# EAGLE design lens (EAGLE 7.7.0)
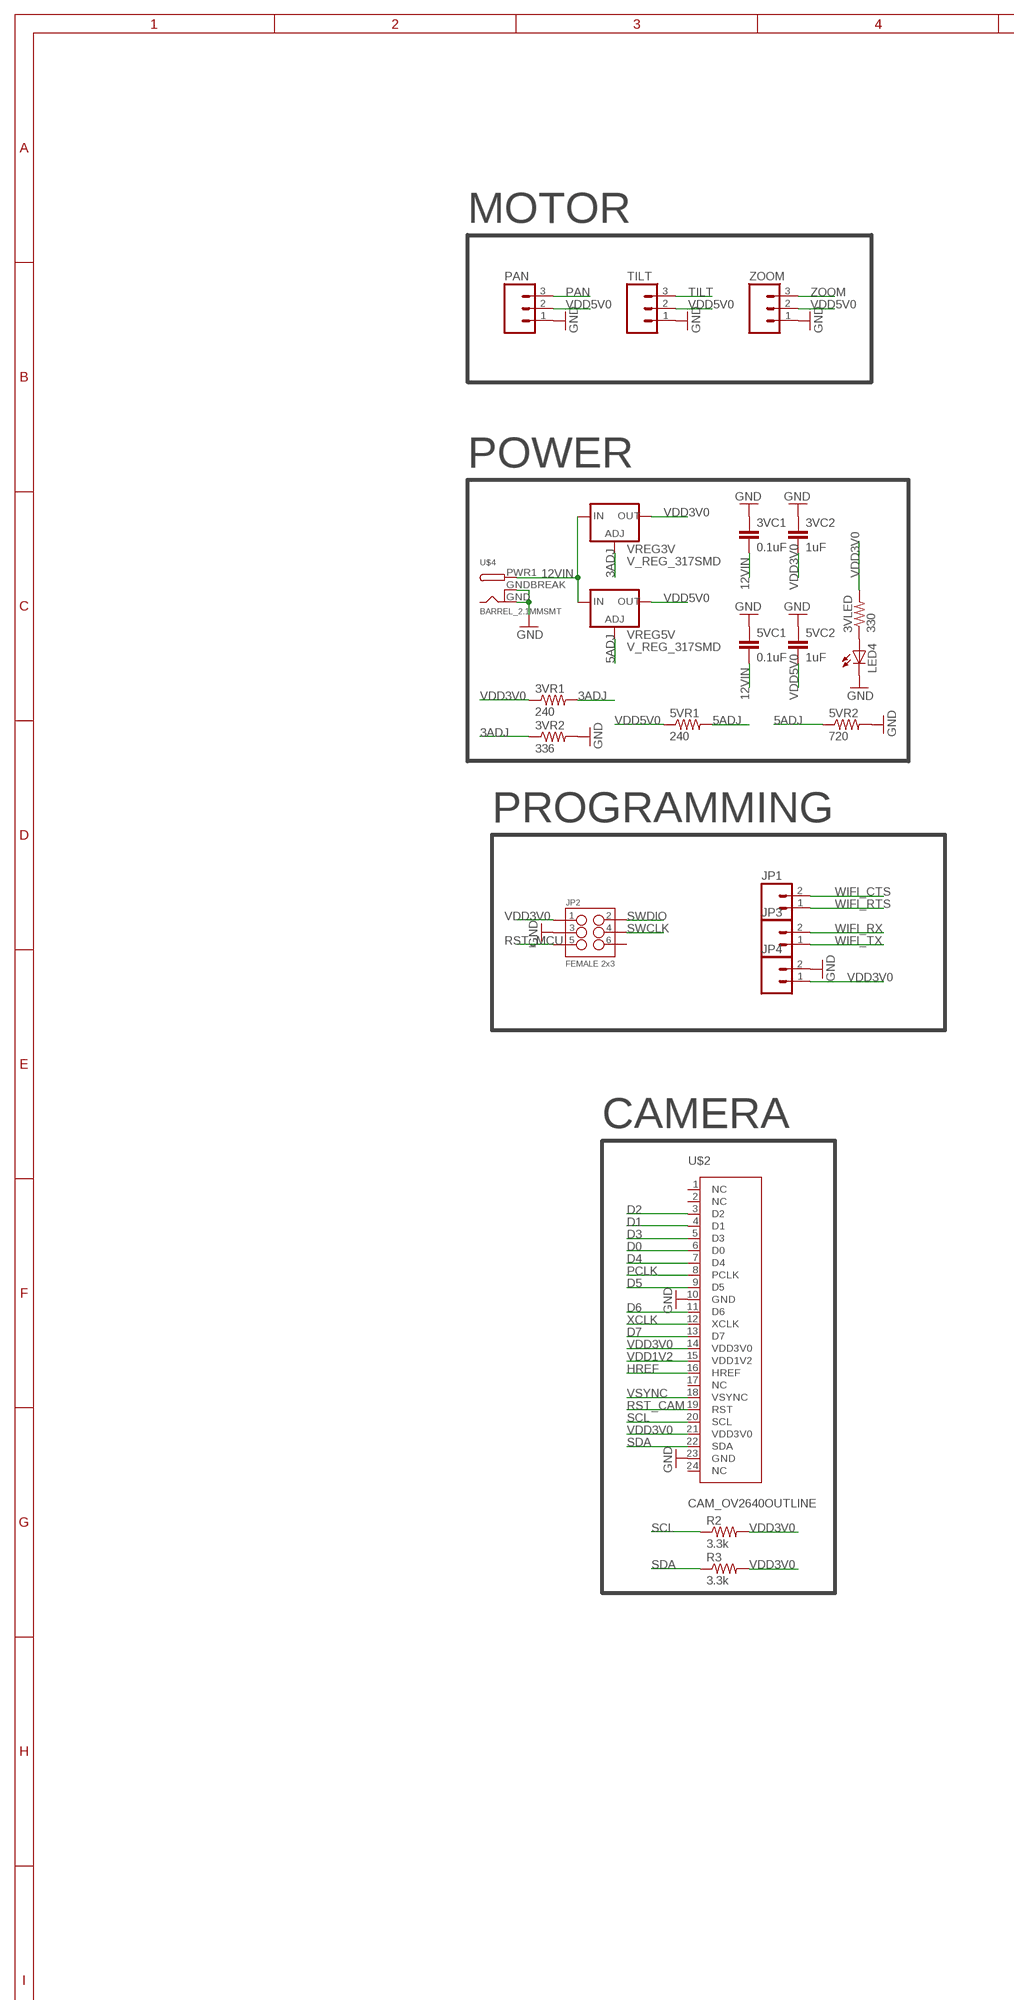
[diagram p0: schematic, sheet 1, part 1 of 2]
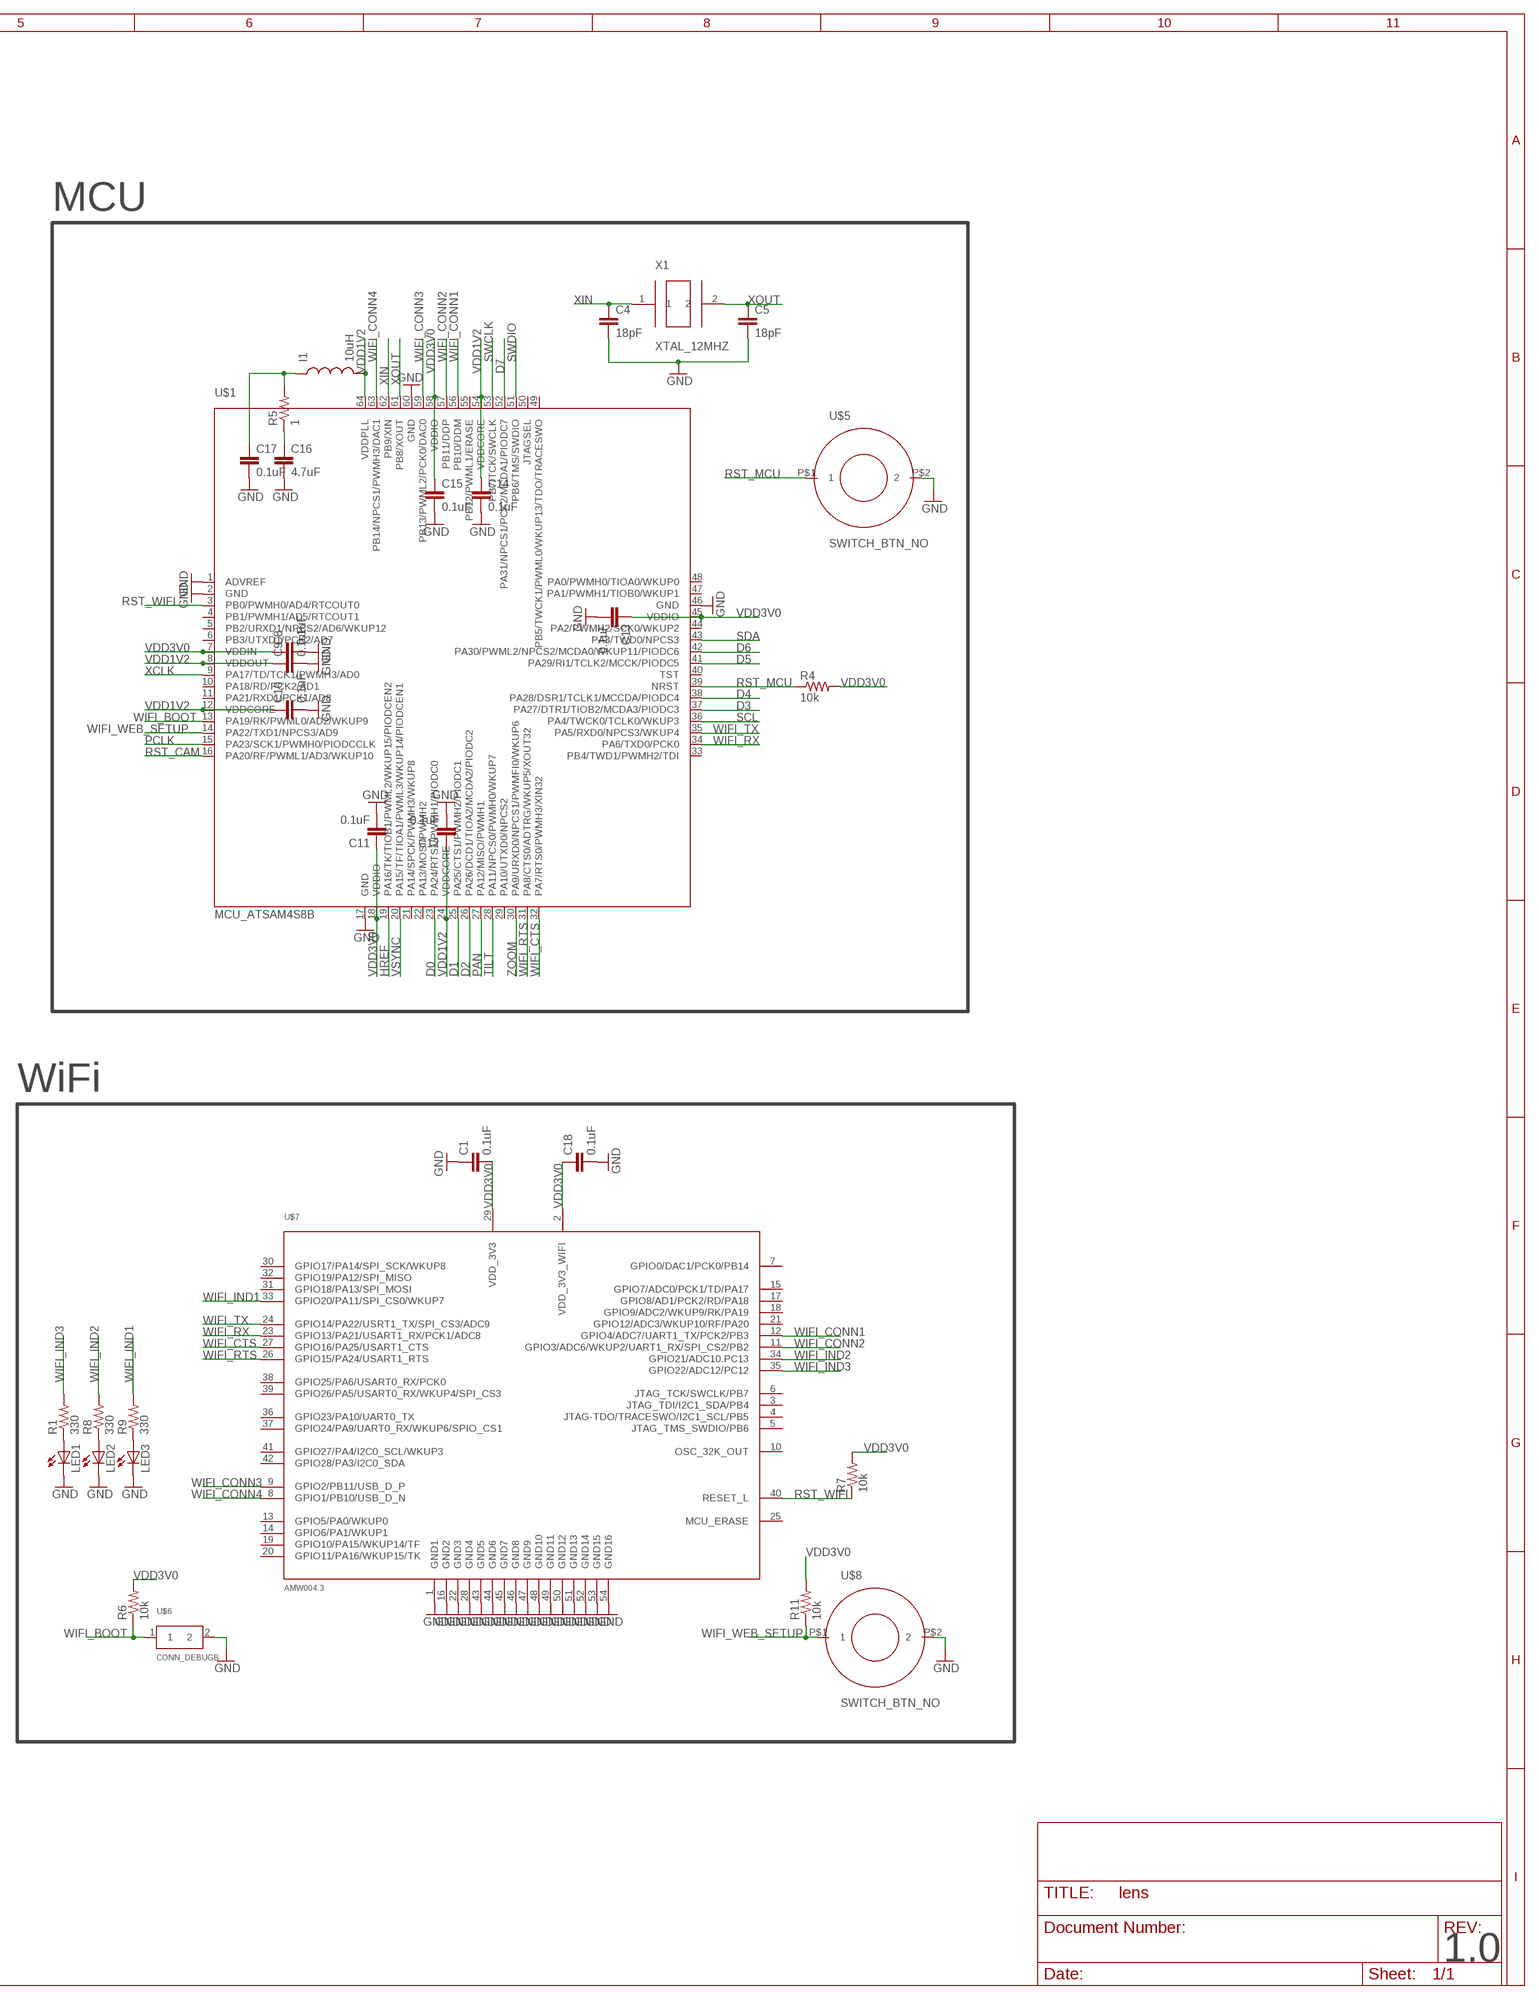
[diagram p1: schematic, sheet 1, part 2 of 2]

## Parts
3VC1  0.1uF  CAP  [0805]
3VC2  1uF  CAP  [0805]
3VLED  330  RES  [0805]
3VR1  240  RES  [0805]
3VR2  336  RES  [0805]
5VC1  0.1uF  CAP  [0805]
5VC2  1uF  CAP  [0805]
5VR1  240  RES  [0805]
5VR2  720  RES  [0805]
C1  0.1uF  CAP  [0805]
C4  18pF  CAP  [0805]
C5  18pF  CAP  [0805]
C8  0.1uF  CAP  [0805]
C9  0.1uF  CAP  [0805]
C10  0.1uF  CAP  [0805]
C11  0.1uF  CAP  [0805]
C12  0.1uF  CAP  [0805]
C13  0.1uF  CAP  [0805]
C14  0.1uF  CAP  [0805]
C15  0.1uF  CAP  [0805]
C16  4.7uF  CAP  [0805]
C17  0.1uF  CAP  [0805]
C18  0.1uF  CAP  [0805]
I1  10uH  IND  [0805]
JP1  M02PTH  [1X02]
JP2  FEMALE 2x3  M03X2FEMALE  [2X3]
JP3  M02PTH  [1X02]
JP4  M02PTH  [1X02]
LED1  LED0603  [LED-0603]
LED2  LED0603  [LED-0603]
LED3  LED0603  [LED-0603]
LED4  LED0603  [LED-0603]
PAN  M03PTH  [1X03]
R1  330  RES  [0805]
R2  3.3k  RES  [0805]
R3  3.3k  RES  [0805]
R4  10k  RES  [0805]
R5  1  RES  [0805]
R6  10k  RES  [0805]
R7  10k  RES  [0805]
R8  330  RES  [0805]
R9  330  RES  [0805]
R11  10k  RES  [0805]
TILT  M03PTH  [1X03]
U$1  MCU_ATSAM4S8B  [QFP50P1200X1200X160-64N]
U$2  CAM_OV2640OUTLINE  [CAM_CONN]
U$4  BARREL_2.1MMSMT  [DCJACK_2MM_SMT]
U$5  SWITCH_BTN_NO  [BTN_2]
U$6  CONN_DEBUGB  [1X2_SMALL_SMD]
U$7  AMW004.3  [AMW004]
U$8  SWITCH_BTN_NO  [BTN_2]
VREG3V  V_REG_317SMD  [SOT223]
VREG5V  V_REG_317SMD  [SOT223]
X1  XTAL_12MHZ  [ABM7-16.000MHZ-D2Y-T]
ZOOM  M03PTH  [1X03]

## Nets
3ADJ: 3VR1.2 3VR2.1 VREG3V.1(ADJ)
5ADJ: 5VR1.2 5VR2.1 VREG5V.1(ADJ)
12VIN: 3VC1.2 5VC1.2 U$4.PWR1(PWR) VREG3V.3(IN) VREG5V.3(IN)
D0: U$1.23(PA24/RTS1/PWMH1/PIODC0) U$2.6(D0)
D1: U$1.25(PA25/CTS1/PWMH2/PIODC1) U$2.4(D1)
D2: U$1.26(PA26/DCD1/TIOA2/MCDA2/PIODC2) U$2.3(D2)
D3: U$1.37(PA27/DTR1/TIOB2/MCDA3/PIODC3) U$2.5(D3)
D4: U$1.38(PA28/DSR1/TCLK1/MCCDA/PIODC4) U$2.7(D4)
D5: U$1.41(PA29/RI1/TCLK2/MCCK/PIODC5) U$2.9(D5)
D6: U$1.42(PA30/PWML2/NPCS2/MCDA0/WKUP11/PIODC6) U$2.11(D6)
D7: U$1.52(PA31/NPCS1/PCK2/MCDA1/PIODC7) U$2.13(D7)
GND: 3VC1.1 3VC2.1 3VR2.2 5VC1.1 5VC2.1 5VR2.2 C1.1 C4.2 C5.2 C8.2 C9.2 C10.2 C11.2 C12.2 C13.2 C14.2 C15.2 C16.2 C17.2 C18.2 JP2.3 JP4.2 LED1.C LED2.C LED3.C LED4.C PAN.1 TILT.1 U$1.1(ADVREF) U$1.2(GND) U$1.17(GND) U$1.46(GND) U$1.60(GND) U$2.10(GND) U$2.23(GND) U$4.GND U$4.GNDBREAK U$5.P$2 U$6.2 U$7.1(GND1) U$7.16(GND2) U$7.22(GND3) U$7.28(GND4) U$7.43(GND5) U$7.44(GND6) U$7.45(GND7) U$7.46(GND8) U$7.47(GND9) U$7.48(GND10) U$7.49(GND11) U$7.50(GND12) U$7.51(GND13) U$7.52(GND14) U$7.53(GND15) U$7.54(GND16) U$8.P$2 ZOOM.1
HREF: U$1.19(PA16/TK/TIOB1/PWML2/WKUP15/PIODCEN2) U$2.16(HREF)
N$2: C17.1 I1.1 R5.2
N$3: C16.1 R5.1
N$4: LED1.A R1.1
N$5: LED2.A R8.1
N$6: LED3.A R9.1
N$7: 3VLED.1 LED4.A
PAN: PAN.3 U$1.27(PA12/MISO/PWMH1)
PCLK: U$1.15(PA23/SCK1/PWMH0/PIODCCLK) U$2.8(PCLK)
RST_CAM: U$1.16(PA20/RF/PWML1/AD3/WKUP10) U$2.19(RST)
RST_MCU: JP2.5 R4.1 U$1.39(NRST) U$5.P$1
RST_WIFI: R7.1 U$1.3(PB0/PWMH0/AD4/RTCOUT0) U$7.40(RESET_L)
SCL: R2.1 U$1.36(PA4/TWCK0/TCLK0/WKUP3) U$2.20(SCL)
SDA: R3.1 U$1.43(PA3/TWD0/NPCS3) U$2.22(SDA)
SWCLK: JP2.4 U$1.53(PB7/TCK/SWCLK)
SWDIO: JP2.2 U$1.51(PB6/TMS/SWDIO)
TILT: TILT.3 U$1.28(PA11/NPCS0/PWMH0/WKUP7)
VDD1V2: C9.1 C10.1 C12.1 C14.1 I1.2 U$1.8(VDDOUT) U$1.12(VDDCORE) U$1.24(VDDCORE) U$1.54(VDDCORE) U$1.64(VDDPLL) U$2.15(VDD1V2)
VDD3V0: 3VC2.2 3VLED.2 3VR1.1 C1.2 C8.1 C11.1 C13.1 C15.1 C18.1 JP2.1 JP4.1 R2.2 R3.2 R4.2 R6.2 R7.2 R11.2 U$1.7(VDDIN) U$1.18(VDDIO) U$1.45(VDDIO) U$1.58(VDDIO) U$2.14(VDD3V0) U$2.21(VDD3V0) U$7.2(VDD_3V3_WIFI) U$7.29(VDD_3V3) VREG3V.2(OUT)
VDD5V0: 5VC2.2 5VR1.1 PAN.2 TILT.2 VREG5V.2(OUT) ZOOM.2
VSYNC: U$1.20(PA15/TF/TIOA1/PWML3/WKUP14/PIODCEN1) U$2.18(VSYNC)
WIFI_BOOT: R6.1 U$1.13(PA19/RK/PWML0/AD2/WKUP9) U$6.1
WIFI_CONN1: U$1.56(PB10/DDM) U$7.12(GPIO4/ADC7/UART1_TX/PCK2/PB3)
WIFI_CONN2: U$1.57(PB11/DDP) U$7.11(GPIO3/ADC6/WKUP2/UART1_RX/SPI_CS2/PB2)
WIFI_CONN3: U$1.59(PB13/PWML2/PCK0/DAC0) U$7.9(GPIO2/PB11/USB_D_P)
WIFI_CONN4: U$1.63(PB14/NPCS1/PWMH3/DAC1) U$7.8(GPIO1/PB10/USB_D_N)
WIFI_CTS: JP1.2 U$1.32(PA7/RTS0/PWMH3/XIN32) U$7.27(GPIO16/PA25/USART1_CTS)
WIFI_IND1: R9.2 U$7.33(GPIO20/PA11/SPI_CS0/WKUP7)
WIFI_IND2: R8.2 U$7.34(GPIO21/ADC10.PC13)
WIFI_IND3: R1.2 U$7.35(GPIO22/ADC12/PC12)
WIFI_RTS: JP1.1 U$1.31(PA8/CTS0/ADTRG/WKUP5/XOUT32) U$7.26(GPIO15/PA24/USART1_RTS)
WIFI_RX: JP3.2 U$1.34(PA6/TXD0/PCK0) U$7.23(GPIO13/PA21/USART1_RX/PCK1/ADC8)
WIFI_TX: JP3.1 U$1.35(PA5/RXD0/NPCS3/WKUP4) U$7.24(GPIO14/PA22/USRT1_TX/SPI_CS3/ADC9)
WIFI_WEB_SETUP: R11.1 U$1.14(PA22/TXD1/NPCS3/AD9) U$8.P$1
XCLK: U$1.9(PA17/TD/TCK1/PWMH3/AD0) U$2.12(XCLK)
XIN: C4.1 U$1.62(PB9/XIN) X1.1
XOUT: C5.1 U$1.61(PB8/XOUT) X1.2
ZOOM: U$1.30(PA9/URXD0/NPCS1/PWMFI0/WKUP6) ZOOM.3
Unconnected: JP2.6 U$1.4(PB1/PWMH1/AD5/RTCOUT1) U$1.5(PB2/URXD1/NPCS2/AD6/WKUP12) U$1.6(PB3/UTXD1/PCK2/AD7) U$1.10(PA18/RD/PCK2/AD1) U$1.11(PA21/RXD1/PCK1/AD8) U$1.21(PA14/SPCK/PWMH3/WKUP8) U$1.22(PA13/MOSI/PWMH2) U$1.29(PA10/UTXD0/NPCS2) U$1.33(PB4/TWD1/PWMH2/TDI) U$1.40(TST) U$1.44(PA2/PWMH2/SCK0/WKUP2) U$1.47(PA1/PWMH1/TIOB0/WKUP1) U$1.48(PA0/PWMH0/TIOA0/WKUP0) U$1.49(PB5/TWCK1/PWML0/WKUP13/TDO/TRACESWO) U$1.50(JTAGSEL) U$1.55(PB12/PWML1/ERASE) U$2.1(NC) U$2.2(NC) U$2.17(NC) U$2.24(NC) U$7.3(JTAG_TDI/I2C1_SDA/PB4) U$7.4(JTAG-TDO/TRACESWO/I2C1_SCL/PB5) U$7.5(JTAG_TMS_SWDIO/PB6) U$7.6(JTAG_TCK/SWCLK/PB7) U$7.7(GPIO0/DAC1/PCK0/PB14) U$7.10(OSC_32K_OUT) U$7.13(GPIO5/PA0/WKUP0) U$7.14(GPIO6/PA1/WKUP1) U$7.15(GPIO7/ADC0/PCK1/TD/PA17) U$7.17(GPIO8/AD1/PCK2/RD/PA18) U$7.18(GPIO9/ADC2/WKUP9/RK/PA19) U$7.19(GPIO10/PA15/WKUP14/TF) U$7.20(GPIO11/PA16/WKUP15/TK) U$7.21(GPIO12/ADC3/WKUP10/RF/PA20) U$7.25(MCU_ERASE) U$7.30(GPIO17/PA14/SPI_SCK/WKUP8) U$7.31(GPIO18/PA13/SPI_MOSI) U$7.32(GPIO19/PA12/SPI_MISO) U$7.36(GPIO23/PA10/UART0_TX) U$7.37(GPIO24/PA9/UART0_RX/WKUP6/SPIO_CS1) U$7.38(GPIO25/PA6/USART0_RX/PCK0) U$7.39(GPIO26/PA5/USART0_RX/WKUP4/SPI_CS3) U$7.41(GPIO27/PA4/I2C0_SCL/WKUP3) U$7.42(GPIO28/PA3/I2C0_SDA)

## Notes on the sheet
- MOTOR | MCU
- POWER
- PROGRAMMING
- CAMERA
- WiFi
- 1.0

## Library data of the parts
3VC1 3VC2 5VC1 5VC2 C1 C4 C5 C8-C18 = Ilya_Teach:CAP
3VLED 3VR1 3VR2 5VR1 5VR2 R1-R9 R11 = Ilya_Teach:RES
I1 = Ilya_Teach:IND
JP1 JP3 JP4 = SparkFun:M02: Header 2 Standard 2-pin 0.1" header. Use with straight break away headers (SKU : PRT-00116), right angle break away headers (PRT-00553), swiss pins (PRT-00743), machine pins (PRT-00117), and female headers (PRT-00115). Molex polarized connector foot print use with SKU : PRT-08233 with associated crimp pins and housings.
JP2 = SparkFun-Connectors:M03X2: 2x3 .1" header. Shrouded, with keying- CONN-10681 SMT- CONN-11415 Pogo pins- HW-11044; PROD_ID: CONN-11566
LED1-LED4 = SparkFun:LED: LEDs Standard schematic elements and footprints for 5mm, 3mm, 1206, and 0603 sized LEDs. 5mm - Spark Fun Electronics SKU : COM-00529 (and others)
PAN TILT ZOOM = SparkFun:M03: Header 3 Standard 3-pin 0.1" header. Use with straight break away headers (SKU : PRT-00116), right angle break away headers (PRT-00553), swiss pins (PRT-00743), machine pins (PRT-00117), and female headers (PRT-00115). Molex polarized connector foot print use with SKU : PRT-08232 with associated crimp pins and housings.
U$1 = Ilya_Teach:MCU_ATSAM4S8B
U$2 = Ilya_Teach:CAM_OV2640
U$4 = Ilya_Teach:BARREL_2.1MM
U$5 U$8 = Ilya_Teach:SWITCH_BTN_NO
U$6 = Ilya3:CONN_DEBUG
U$7 = AMW004_Eagle_PCB_Library:AMW004.3
VREG3V VREG5V = SparkFun-IC-Power:V_REG_317: Voltage Regulator Standard LM317 adjustable voltage regulator. AOI (Adjust Output Input). Google 'LM317 Calculator' for easy to use app to get the two resistor values needed. 240/720 for 5V output. 240/390 for 3.3V output. Spark Fun Electronics SKU : COM-00527
X1 = Ilya_Teach:XTAL_12MHZ

## Board
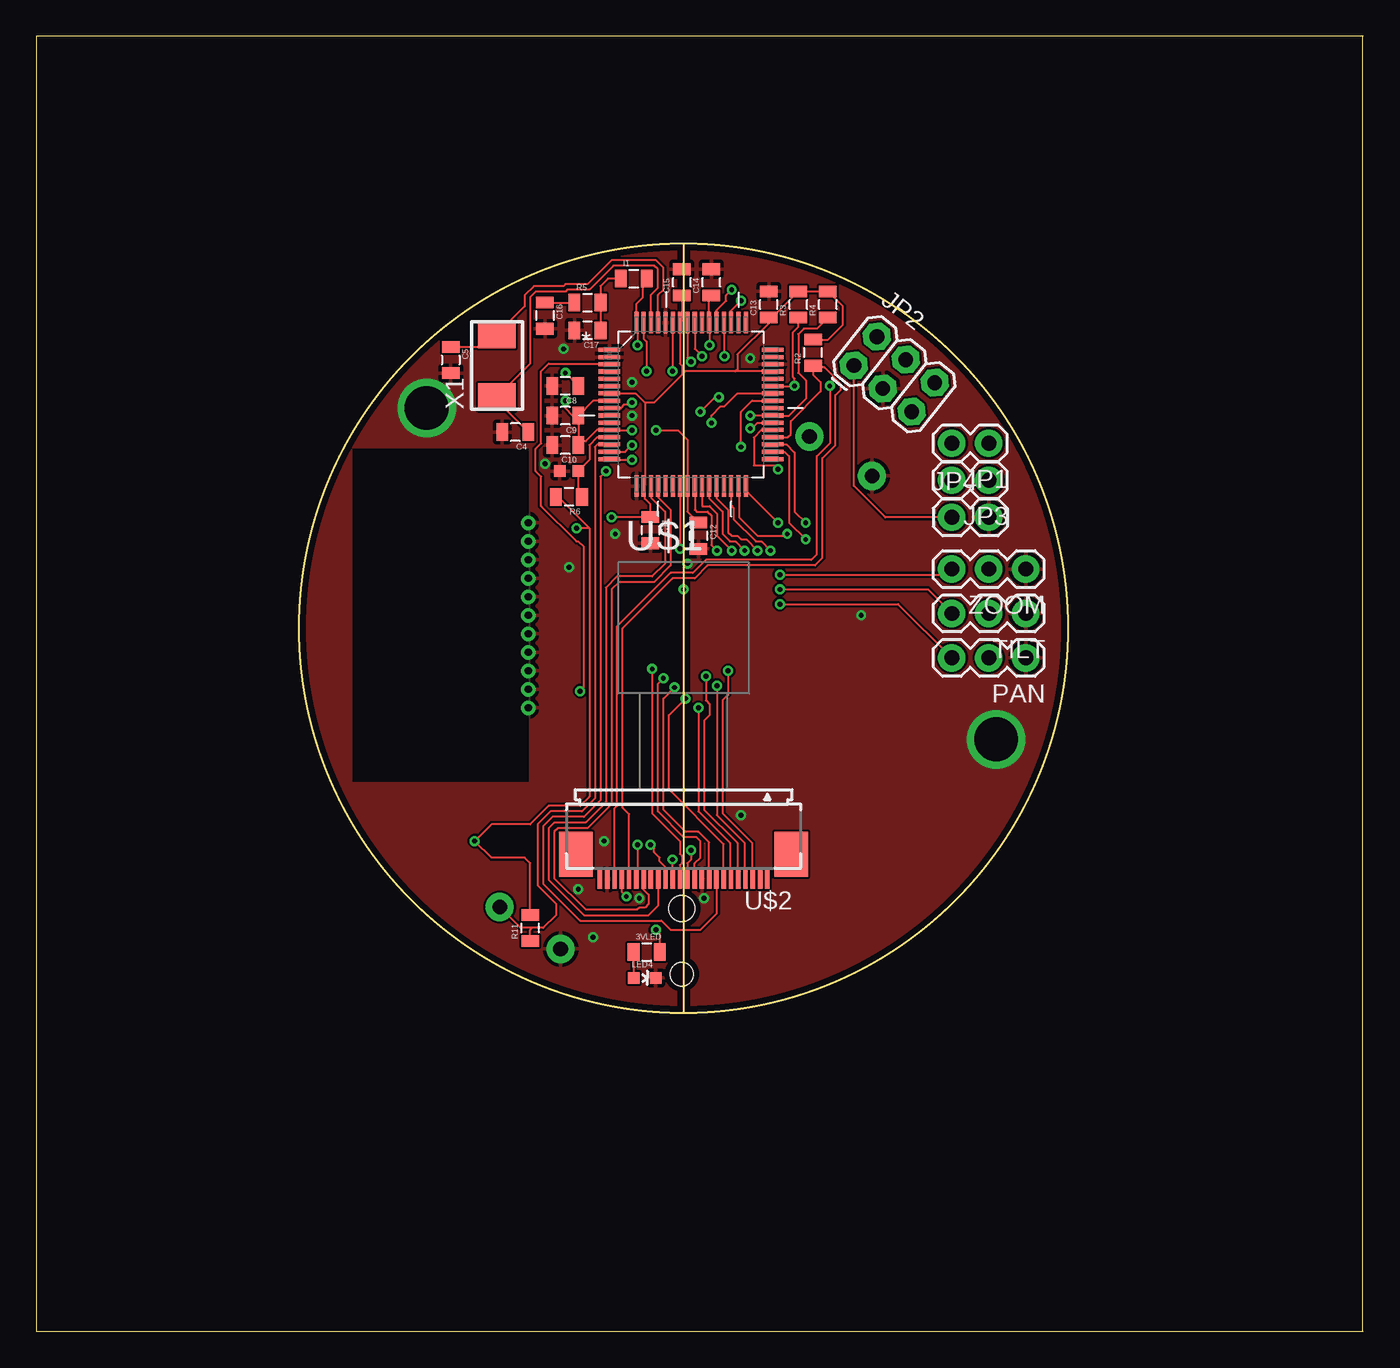
[diagram p2: board, top side]
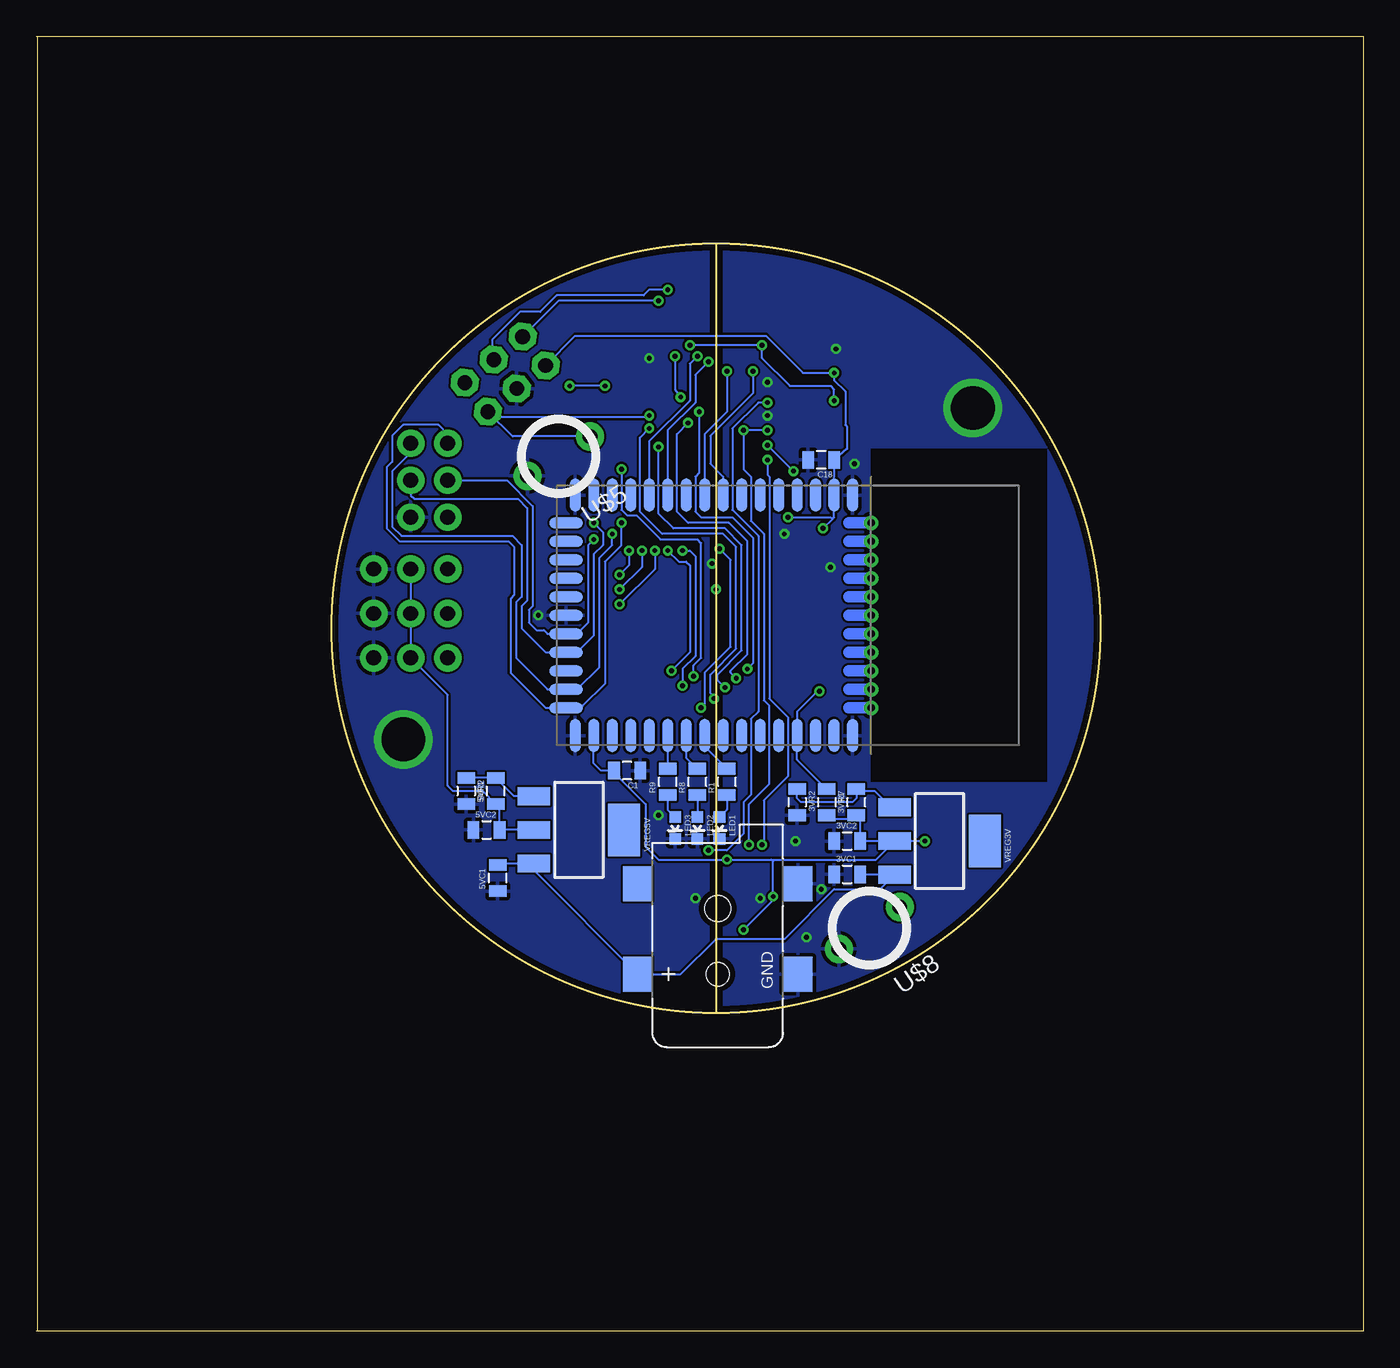
[diagram p3: board, bottom side, seen from below]

Size 91.11 x 88.89 mm. Coordinates in mm from the lower left corner, seen from the top.
Outline: 91.06,0 0,0 0,88.89 91.06,88.89
Outline: 91.06,0 91.11,0
Outline: 91.11,88.89 91.06,88.89
Outline: 91.06,88.89 91.06,0
Outline: circle at 44.45,48.26 radius 26.39
Copper layers (1*16): Top 0.0356mm / dielectric 1.5011mm / Bottom 0.0356mm
Design rules "LaenPCBOrder": minimum track width 6mil, minimum drill 13mil, track to track 6mil, track to pad 6mil, pad to pad 6mil, via to via 6mil, smd to smd 6mil, copper to edge 15mil, drill to drill 6mil, minimum pad ring 7mil, minimum via ring 7mil, stop-mask expansion 3mil, vias tented up to drill 0mil, thermal gap 10mil

### Footprints (pad centres in the part's own frame; a part is rotated, then mirrored left to right if it is on the bottom)
0805 = smd 0.8 x 1.2: 1 -0.9,0; 2 0.9,0
1X02 = drill 1.016 pad 1.88: 1 0,0; 2 2.54,0
2X3 = drill 1.016 pad 1.88 octagon: 1 0,0; 2 0,2.54; 3 2.54,0; 4 2.54,2.54; 5 5.08,0; 6 5.08,2.54
LED-0603 = smd 0.8 x 0.8: A 0,-0.75; C 0,0.75
1X03 = drill 1.016 pad 1.88: 1 0,0; 2 2.54,0; 3 5.08,0
QFP50P1200X1200X160-64N = smd 1.473 x 0.279: 1 -5.613,3.759; 2 -5.613,3.251; 3 -5.613,2.743; 4 -5.613,2.261; 5 -5.613,1.753; 6 -5.613,1.245; 7 -5.613,0.762; 8 -5.613,0.254; 9 -5.613,-0.254; 10 -5.613,-0.762; 11 -5.613,-1.245; 12 -5.613,-1.753; 13 -5.613,-2.261; 14 -5.613,-2.743; 15 -5.613,-3.251; 16 -5.613,-3.759; 33 5.613,-3.759; 34 5.613,-3.251; 35 5.613,-2.743; 36 5.613,-2.261; 37 5.613,-1.753; 38 5.613,-1.245; 39 5.613,-0.762; 40 5.613,-0.254; 41 5.613,0.254; 42 5.613,0.762; 43 5.613,1.245; 44 5.613,1.753; 45 5.613,2.261; 46 5.613,2.743; 47 5.613,3.251; 48 5.613,3.759 | smd 0.279 x 1.473: 17 -3.759,-5.613; 18 -3.251,-5.613; 19 -2.743,-5.613; 20 -2.261,-5.613; 21 -1.753,-5.613; 22 -1.245,-5.613; 23 -0.762,-5.613; 24 -0.254,-5.613; 25 0.254,-5.613; 26 0.762,-5.613; 27 1.245,-5.613; 28 1.753,-5.613; 29 2.261,-5.613; 30 2.743,-5.613; 31 3.251,-5.613; 32 3.759,-5.613; 49 3.759,5.613; 50 3.251,5.613; 51 2.743,5.613; 52 2.261,5.613; 53 1.753,5.613; 54 1.245,5.613; 55 0.762,5.613; 56 0.254,5.613; 57 -0.254,5.613; 58 -0.762,5.613; 59 -1.245,5.613; 60 -1.753,5.613; 61 -2.261,5.613; 62 -2.743,5.613; 63 -3.251,5.613; 64 -3.759,5.613
CAM_CONN = smd 0.3 x 1.3: 1 -5.75,3.25; 2 -5.25,3.25; 3 -4.75,3.25; 4 -4.25,3.25; 5 -3.75,3.25; 6 -3.25,3.25; 7 -2.75,3.25; 8 -2.25,3.25; 9 -1.75,3.25; 10 -1.25,3.25; 11 -0.75,3.25; 12 -0.25,3.25; 13 0.25,3.25; 14 0.75,3.25; 15 1.25,3.25; 16 1.75,3.25; 17 2.25,3.25; 18 2.75,3.25; 19 3.25,3.25; 20 3.75,3.25; 21 4.25,3.25; 22 4.75,3.25; 23 5.25,3.25; 24 5.75,3.25 | smd 2.3 x 3.1: P1 -7.4,1.55; P2 7.4,1.55
DCJACK_2MM_SMT = smd 2.4 x 2: GND -2.54,-5.5; GNDBREAK 3.66,-5.5; PWR1 -2.54,5.5; PWR2 3.66,5.5 | hole 1.6: -2.54,0 | hole 1.8: 1.96,0
BTN_2 = drill 1.016 pad 1.93: P$1 -2.54,0; P$2 2.54,0
1X2_SMALL_SMD = smd 0.762 x 0.762: 1 -0.635,0; 2 0.635,0
AMW004 = smd 0.762 x 2.286: 1 20.32,8.255; 2 19.05,8.255; 3 17.78,8.255; 4 16.51,8.255; 5 15.24,8.255; 6 13.97,8.255; 7 12.7,8.255; 8 11.43,8.255; 9 10.16,8.255; 10 8.89,8.255; 11 7.62,8.255; 12 6.35,8.255; 13 5.08,8.255; 14 3.81,8.255; 15 2.54,8.255; 16 1.27,8.255; 28 1.27,-8.255; 29 2.54,-8.255; 30 3.81,-8.255; 31 5.08,-8.255; 32 6.35,-8.255; 33 7.62,-8.255; 34 8.89,-8.255; 35 10.16,-8.255; 36 11.43,-8.255; 37 12.7,-8.255; 38 13.97,-8.255; 39 15.24,-8.255; 40 16.51,-8.255; 41 17.78,-8.255; 42 19.05,-8.255; 43 20.32,-8.255 | smd 2.286 x 0.762: 17 0.635,6.35; 18 0.635,5.08; 19 0.635,3.81; 20 0.635,2.54; 21 0.635,1.27; 22 0.635,0; 23 0.635,-1.27; 24 0.635,-2.54; 25 0.635,-3.81; 26 0.635,-5.08; 27 0.635,-6.35 | drill 0.5 pad 1: 44 21.59,-6.35; 45 21.59,-5.08; 46 21.59,-3.81; 47 21.59,-2.54; 48 21.59,-1.27; 49 21.59,0; 50 21.59,1.27; 51 21.59,2.54; 52 21.59,3.81; 53 21.59,5.08; 54 21.59,6.35
SOT223 = smd 1.219 x 2.235: 1 -2.311,-3.099; 2 0,-3.099; 3 2.311,-3.099 | smd 3.6 x 2.2: 4 0,3.099
ABM7-16.000MHZ-D2Y-T = smd 1.9 x 2.6: 1 -2.15,0; 2 2.15,0

### Placement (x,y rotation side)
3VC1  35.43,31.37 0 bottom
3VC2  35.43,33.66 0 bottom
3VLED  41.91,26.04 0 top
3VR1  34.8,36.32 90 bottom
3VR2  38.86,36.32 270 bottom
5VC1  59.44,31.11 90 bottom
5VC2  60.2,34.42 0 bottom
5VR1  59.56,37.08 90 bottom
5VR2  61.6,37.08 270 bottom
C1  50.55,38.48 180 bottom
C4  32.89,61.72 180 top
C5  28.45,66.67 270 top
C8  36.32,64.9 180 top
C9  36.32,62.87 180 top
C10  36.32,60.83 180 top
C11  42.16,54.99 270 top
C12  45.47,54.61 270 top
C13  50.29,70.48 90 top
C14  46.36,72.01 90 top
C15  44.32,72.01 90 top
C16  34.93,69.72 270 top
C17  37.85,68.71 180 top
C18  37.21,59.82 180 bottom
I1  41.02,72.26 0 top
JP1  65.4,60.96 180 top
JP2  56.13,66.29 321.5 top
JP3  65.4,58.42 180 top
JP4  62.87,55.88 0 top
LED1  44.2,34.54 180 bottom
LED2  45.72,34.54 180 bottom
LED3  47.24,34.54 180 bottom
LED4  41.78,24.26 270 top
PAN  67.94,46.23 180 top
R1  43.69,37.72 90 bottom
R2  53.34,67.18 90 top
R3  52.32,70.48 90 top
R4  54.36,70.48 90 top
R5  37.85,70.61 0 top
R6  36.58,57.28 180 top
R7  36.83,36.32 270 bottom
R8  45.72,37.72 90 bottom
R9  47.75,37.72 90 bottom
R11  33.91,27.69 90 top
TILT  67.94,49.28 180 top
U$1  44.96,63.63 0 top
U$2  44.45,34.29 180 top
U$4  44.32,27.05 90 bottom
U$5  55.24,60.07 212.3 bottom
U$6  36.58,59.05 180 top
U$7  55.37,49.15 0 bottom
U$8  33.91,27.69 214.6 bottom
VREG3V  29.08,33.66 270 bottom
VREG5V  53.85,34.42 270 bottom
X1  31.62,66.29 90 top
ZOOM  67.94,52.32 180 top

### Tracks (layer width: path | path; a pad name or v marks a point on that pad's centre or on a via)
3ADJ
  Bottom 0.152: 3VR2.1 38.86,36.58 38.61,36.32 35.05,36.32 34.8,36.58 3VR1.2 34.66,37.08 33.53,37.08 32.41,35.97 VREG3V.1
5ADJ
  Bottom 0.152: VREG5V.1 58.31,36.73 5VR1.2 5VR2.1
12VIN
  Bottom 0.152: 3VC1.2 34.51,31.34 VREG3V.3 33.17,30.35 36.32,30.35 39.75,26.92 44.45,26.92 46.86,24.51 U$4.PWR1 56.95,31.64 VREG5V.3 59.34,32.11 5VC1.2
D0  (via drill 0.33)
  Top 0.152: U$1.23 v44.2,53.72 | v45.47,42.8 45.47,35.69 47.62,33.53 47.62,31.11 U$2.6
  Bottom 0.152: v45.47,42.8 45.21,43.05 45.21,45.21 43.43,46.99 43.43,52.96 v44.2,53.72
D1  (via drill 0.33)
  Top 0.152: U$1.25 45.21,56.39 45.34,56.26 46.1,56.26 46.36,56.01 46.36,53.98 v46.74,53.59 | v46.74,44.32 46.74,35.43 48.64,33.53 48.64,31.1 U$2.4
  Bottom 0.152: v46.74,53.59 46.23,53.59 45.85,53.21 45.85,46.35 46.74,45.47 v46.74,44.32
D2  (via drill 0.33)
  Top 0.152: U$1.26 45.72,56.64 46.23,56.64 46.74,56.13 46.74,54.61 v47.75,53.59 | v47.5,45.34 47.5,43.69 47.12,43.31 47.12,35.56 49.15,33.53 49.15,31.09 U$2.3
  Bottom 0.152: v47.75,53.59 46.99,52.83 46.48,52.83 46.23,52.58 46.23,46.61 v47.5,45.34
D3  (via drill 0.33)
  Top 0.152: U$1.37 49.81,61.87 49.28,61.34 49.28,59.44 50.67,59.44 v50.93,59.18 | v45.97,44.96 45.97,43.31 46.23,43.05 46.23,42.29 45.85,41.91 45.85,35.81 48.13,33.53 48.13,31.11 U$2.5
  Bottom 0.152: v50.93,59.18 50.93,56.39 50.55,56.01 49.91,56.01 48.26,54.36 45.72,54.36 45.47,54.1 45.47,46.23 45.97,45.72 v45.97,44.96
D4  (via drill 0.33)
  Top 0.152: U$2.7 47.2,33.45 43.43,37.21 43.43,42.29 v44.58,43.43 | v49.02,61.98 49.15,61.98 49.53,62.36 50.55,62.36 U$1.38
  Bottom 0.152: v44.58,43.43 44.58,43.56 44.83,43.81 44.83,45.09 43.05,46.86 43.05,53.85 43.94,54.74 48.13,54.74 49.66,56.26 49.66,61.34 v49.02,61.98
D5  (via drill 0.33)
  Top 0.152: v43.81,44.2 43.05,43.43 43.05,35.81 44.58,34.29 45.47,34.29 46.2,33.56 U$2.9 | v48.39,60.71 48.39,63.12 49.15,63.88 U$1.41
  Bottom 0.152: v43.81,44.2 44.32,44.7 44.32,45.09 42.67,46.74 42.67,53.98 43.81,55.12 47.37,55.12 48.39,56.13 v48.39,60.71
D6  (via drill 0.33)
  Top 0.152: U$2.11 45.2,32.12 45.59,32.51 45.59,33.66 45.34,33.91 44.45,33.91 42.67,35.69 42.67,44.45 v43.05,44.83 | v46.36,62.36 46.36,62.87 46.99,63.5 47.24,63.5 48.13,64.39 U$1.42
  Bottom 0.152: v43.05,44.83 43.43,45.21 43.43,45.34 42.29,46.48 42.29,54.23 43.56,55.5 46.36,55.5 47.12,56.26 47.12,61.59 v46.36,62.36
D7  (via drill 0.33)
  Top 0.152: U$1.52 47.22,66.95 v47.24,66.93 | v46.86,64.14 46.61,64.14 v45.59,63.12 | v42.29,45.47 42.29,35.56 44.2,33.66 44.2,32.77 44.32,32.64 44.32,32.13 44.2,32 U$2.13
  Bottom 0.152: v47.24,66.93 47.24,64.64 v46.86,64.14 | v45.59,63.12 45.59,58.93 45.85,58.67 45.85,56.26 45.47,55.88 43.31,55.88 41.91,54.48 41.91,45.85 v42.29,45.47
GND  (via drill 0.33, 3)
  other vias: 65.91,40.64 26.8,63.37 34.93,59.56 49.02,66.8 36.2,67.44 39.75,54.74 56.64,49.15 45.85,29.72 40.89,65.15 40.89,62.87 44.7,52.7 36.58,52.45 44.45,50.93 38.99,33.66 37.21,30.35 38.23,27.05 41.4,29.72 48.39,35.43
  pour Bottom: 0,0 91.06,0 91.06,88.9 0,88.9
  pour Top: 0,0 91.06,0 91.06,88.9 0,88.9
HREF
  Top 0.152: U$1.19 42.22,57.23 43.18,56.26 43.18,52.7 42.29,51.82 39.88,51.82 39.12,51.05 39.12,36.32 37.72,34.92 35.56,34.92 35.18,34.54 35.18,30.99 37.59,28.57 42.04,28.57 42.67,29.21 42.67,31.01 U$2.16
N$2
  Top 0.152: I1.1 39.24,72.26 38.73,71.75 38.73,70.62 R5.2 C17.1
N$3
  Top 0.152: C16.1 36.94,70.62 R5.1
N$4
  Bottom 0.152: R1.1 43.69,35.8 LED1.A
N$5
  Bottom 0.152: R8.1 LED2.A
N$6
  Bottom 0.152: R9.1 47.75,35.8 LED3.A
N$7
  Top 0.152: 3VLED.1 41.01,24.28 LED4.A
PAN  (via drill 0.33)
  Top 0.152: v51.05,49.91 59.18,49.91 PAN.3 | U$1.27 46.2,57.17 47.12,56.26 47.12,54.74 47.62,54.23 48.01,54.23 v48.64,53.59
  Bottom 0.152: v48.64,53.59 48.64,52.32 v51.05,49.91
PCLK  (via drill 0.33)
  Top 0.152: U$1.15 40.44,60.38 v40.89,60.83 | v39.12,59.05 38.73,58.67 38.73,36.45 37.59,35.31 35.43,35.31 34.8,34.67 34.8,30.73 37.34,28.19 42.93,28.19 43.56,27.56 45.59,27.56 46.74,28.7 46.74,31 U$2.8
  Bottom 0.152: v40.89,60.83 v39.12,59.05
RST_CAM  (via drill 0.33)
  Top 0.152: U$1.16 39.34,59.82 v40.89,59.82 | v41.27,33.4 41.27,31.11 U$2.19
  Bottom 0.152: v41.27,33.4 41.15,33.53 41.15,36.45 39.5,38.1 39.5,42.16 40.77,43.43 40.77,58.67 40.89,58.8 v40.89,59.82
RST_MCU  (via drill 0.33)
  Top 0.152: R4.1 53.61,68.83 52.7,68.83 52.32,68.45 52.32,65.79 52.83,65.28 52.83,64.01 51.69,62.87 U$1.39 v49.02,62.87
  Bottom 0.152: v49.02,62.87 49.15,62.74 59.72,62.74 JP2.5 58.41,61.43 U$5.P$1
RST_WIFI  (via drill 0.33)
  Top 0.152: U$1.3 39.29,66.42 35.18,66.42 34.67,65.91 34.67,60.96 34.29,60.58 34.29,59.05 34.67,58.67 34.67,56.64 37.08,54.23 37.21,54.23 37.59,53.85 37.59,44.2 v37.34,43.94
  Bottom 0.152: R7.1 36.84,37.22 38.86,39.24 U$7.40 38.86,42.55 37.47,43.94 v37.34,43.94
SCL
  Top 0.152: U$1.36 51.59,61.37 51.82,61.59 51.82,62.48 53.85,64.52 53.85,65.15 53.34,65.66 R2.1 53.46,66.17 54.1,66.17 55.24,65.02 55.24,64.64 54.86,64.26 54.86,60.83 53.98,59.94 53.98,53.09 53.47,52.58 46.1,52.58 45.21,51.69 43.69,51.69 40.26,48.26 40.26,35.94 40.7,35.5 U$2.20
SDA  (via drill 0.33)
  Top 0.152: U$2.22 39.7,35.89 39.88,36.07 39.88,48.39 43.56,52.07 45.09,52.07 45.97,52.96 53.21,52.96 53.59,53.34 53.59,60.07 54.48,60.96 v54.48,64.9 | U$1.43 52.05,64.87 v52.07,64.9 52.07,65.41 51.94,65.53 51.94,68.58 52.32,68.96 R3.1
  Bottom 0.152: v52.07,64.9 v54.48,64.9
SWCLK  (via drill 0.33)
  Top 0.152: U$1.53 46.71,70.08 47.37,70.74 47.37,71.12 v47.75,71.5
  Bottom 0.152: v47.75,71.5 49.02,71.5 49.4,71.12 55.37,71.12 56.52,69.98 57.91,69.98 59.82,68.07 59.82,66.81 JP2.4
SWDIO  (via drill 0.33)
  Top 0.152: U$1.51 47.7,70.05 v48.39,70.74
  Bottom 0.152: v48.39,70.74 55.26,70.74 JP2.2
TILT  (via drill 0.33)
  Top 0.152: v51.05,50.93 61.21,50.93 TILT.3 | U$1.28 46.71,57.17 47.5,56.39 47.5,54.86 47.75,54.61 48.13,54.61 48.39,54.36 48.77,54.36 v49.53,53.59
  Bottom 0.152: v49.53,53.59 49.53,52.45 v51.05,50.93
VDD1V2  (via drill 0.33)
  Top 0.152: 46.23,70.98 C14.1 46.2,70.96 U$1.54 46.23,69.24 v46.23,67.69 | I1.2 41.66,72 41.66,70.99 41.2,70.54 U$1.64 41.27,69.24 v41.27,67.69 | U$1.8 38.24,63.88 C9.1 | v40.89,61.85 39.34,61.85 U$1.12 38.51,61.87 37.72,61.09 37.48,61.09 C10.1 C9.1 | C9.1 36.83,62.87 36.32,63.37 v36.32,63.88 | v42.55,61.85 44.07,61.85 44.7,61.21 U$1.24 44.7,56.27 C12.1 | v42.16,33.4 42.42,33.15 42.42,32.89 42.8,32.51 42.8,32.26 43.2,31.86 U$2.15
  Bottom 0.152: v40.89,61.85 v42.55,61.85 42.55,59.18 42.04,58.67 42.04,55.63 41.15,54.74 41.15,43.31 40.77,42.93 40.77,37.59 42.16,36.2 v42.16,33.4 | v36.32,63.88 36.32,64.64 36.58,64.9 39.37,64.9 41.27,66.8 v41.27,67.69 v46.23,67.69
VDD3V0  (via drill 0.33)
  Top 0.152: C15.1 44.32,69.37 U$1.58 44.2,66.42 44.32,66.29 44.32,65.66 | R6.2 35.81,57.28 37.97,55.12 | 37.97,55.12 37.97,36.7 37.34,36.07 35.18,36.07 33.91,34.8 31.24,34.8 v30.1,33.66 31.24,32.51 33.53,32.51 33.91,32.13 R11.2 | U$1.7 41.15,64.39 41.78,63.75 | 41.78,63.75 41.78,58.09 U$1.18 41.78,57.94 41.78,57.15 42.16,56.77 C11.1 40.78,55.89 v39.5,55.88 | 44.32,65.66 42.42,63.75 41.78,63.75 | U$1.45 48.01,65.89 | 48.01,65.89 44.55,65.89 44.32,65.66 | R2.2 54.37,68.08 55.37,69.09 55.37,70.37 R4.2 R3.2 50.52,69.58 C13.1 50.29,69.22 48.13,67.06 48.13,66.02 48.01,65.89 | C8.1 v36.32,65.79 | 37.97,55.12 v37.08,55.12 | JP4.1 58.29,55.88 56.13,58.04 JP2.1 | U$2.14 v43.7,32.37 v43.69,32.38 | U$2.21 40.2,30.16 v40.51,29.84 | 3VLED.2 42.81,27.29 v42.55,27.56
  Bottom 0.152: VREG3V.2 3VC2.2 34.53,35.16 | 34.53,35.16 3VR1.1 | 34.53,35.16 36.56,35.16 R7.2 | v30.1,33.66 VREG3V.2 | JP2.1 54.1,68.33 41.02,68.33 38.48,65.79 v36.32,65.79 36.32,65.28 35.56,64.52 35.56,62.23 35.43,62.1 35.43,60.57 C18.1 U$7.2 36.32,55.88 36.45,55.75 | v37.08,55.12 36.45,55.75 | v39.5,55.88 36.58,55.88 36.45,55.75 | 40.64,32.38 v43.69,32.38 48.39,32.38 49.28,33.27 49.28,36.2 51.05,37.97 51.05,38.09 C1.2 52.32,38.48 52.83,38.99 U$7.29 | 40.64,32.38 33.45,32.38 VREG3V.2 | 40.64,32.38 40.51,32.26 v40.51,29.84 40.51,29.59 v42.55,27.56
VDD5V0
  Bottom 0.152: ZOOM.2 TILT.2 PAN.2 62.87,43.69 62.87,37.47 62.48,37.08 60.45,37.08 59.56,36.2 5VR1.1 59.3,35.92 5VC2.2 VREG5V.2
VSYNC
  Top 0.152: U$1.20 42.7,57.25 43.56,56.39 43.56,52.58 42.42,51.44 40.01,51.44 39.5,50.93 39.5,36.2 37.85,34.54 35.81,34.54 35.56,34.29 35.56,31.11 37.72,28.96 41.27,28.96 41.4,29.08 41.78,29.08 42.04,29.34 42.04,29.97 41.66,30.35 41.66,31 U$2.18
WIFI_BOOT
  Top 0.152: U$1.13 38.51,61.37 37.97,60.83 37.97,59.82 U$6.1 37.21,57.54 R6.1
WIFI_CONN1  (via drill 0.33)
  Top 0.152: U$1.56 45.21,67.44 v45.72,66.93
  Bottom 0.152: v45.72,66.93 46.23,66.42 46.23,63.88 49.02,61.09 U$7.12
WIFI_CONN2  (via drill 0.33)
  Top 0.152: U$1.57 44.7,66.8 v44.96,66.55
  Bottom 0.152: v44.96,66.55 45.85,65.66 45.85,63.75 47.75,61.85 U$7.11
WIFI_CONN3  (via drill 0.33)
  Top 0.152: U$1.59 43.69,69.24 v43.69,65.91
  Bottom 0.152: v43.69,65.91 43.69,63.12 45.21,61.59 U$7.9
WIFI_CONN4  (via drill 0.33)
  Top 0.152: U$1.63 41.71,68.15 41.91,67.94 v41.91,65.91
  Bottom 0.152: v41.91,65.91 41.91,64.39 44.83,61.47 44.83,59.56 43.94,58.67 U$7.8
WIFI_CTS  (via drill 0.33)
  Top 0.152: U$1.32 48.72,57.71 v50.93,55.5
  Bottom 0.152: JP1.2 62.87,61.59 63.5,62.23 65.91,62.23 66.67,61.47 66.67,59.69 67.06,59.31 67.06,55.12 66.17,54.23 58.67,54.23 58.29,53.85 58.29,50.55 58.55,50.29 58.55,45.21 56.13,42.8 U$7.27 54.61,42.93 53.59,42.93 52.07,44.45 52.07,52.83 50.93,53.98 v50.93,55.5
WIFI_IND1
  Bottom 0.152: U$7.33 R9.2
WIFI_IND2
  Bottom 0.152: U$7.34 46.48,39.38 R8.2
WIFI_IND3
  Bottom 0.152: U$7.35 45.21,40.14 R1.2
WIFI_RTS  (via drill 0.33)
  Top 0.152: U$1.31 48.26,57.96 48.26,55.88 49.53,54.61 51.44,54.61 v51.56,54.74
  Bottom 0.152: JP1.1 65.4,60.33 66.67,59.05 66.67,55.24 66.04,54.61 58.42,54.61 57.79,53.98 57.79,50.42 58.17,50.04 58.17,46.23 56.01,44.07 U$7.26 53.98,44.07 52.45,45.59 52.45,53.09 51.56,53.98 v51.56,54.74
WIFI_RX  (via drill 0.33)
  Top 0.152: U$1.34 51.38,60.38 51.69,60.07 51.69,55.5 v52.83,54.36
  Bottom 0.152: v52.83,54.36 53.21,53.98 53.21,48.64 53.98,47.88 U$7.23 56.01,47.88 56.26,48.13 56.77,48.13 57.28,48.64 57.28,49.53 57.02,49.78 57.02,56.64 58.8,58.42 JP3.2
WIFI_TX  (via drill 0.33)
  Top 0.152: U$1.35 51.51,60.88 52.07,60.33 52.07,56.26 v52.83,55.5
  Bottom 0.152: v52.83,55.5 52.2,54.86 52.2,53.98 52.83,53.34 52.83,47.75 53.85,46.74 54.23,46.74 | 54.23,46.74 54.61,46.74 U$7.24 | JP3.1 65.4,57.4 65.15,57.15 58.04,57.15 57.4,56.52 57.4,50.16 57.79,49.78 57.79,48.26 56.13,46.61 54.36,46.61 54.23,46.74
WIFI_WEB_SETUP
  Top 0.152: U$1.14 38.53,60.88 38.35,60.71 38.35,36.58 37.47,35.69 35.31,35.69 34.42,34.8 34.42,30.61 35.69,29.34 35.69,28.57 34.8,27.69 34.04,27.69 | 34.04,27.69 33.26,27.69 U$8.P$1 | R11.1 33.91,27.56 34.04,27.69
XCLK  (via drill 0.33)
  Top 0.152: v44.96,33.02 44.96,32.38 44.7,32.13 U$2.12 | U$1.9 40.13,63.37 40.39,63.63 40.77,63.63 v40.89,63.75
  Bottom 0.152: v44.96,33.02 43.69,33.02 42.55,34.16 42.55,36.32 42.04,36.83 42.04,42.04 41.53,42.55 41.53,54.61 43.31,56.39 43.31,61.98 41.53,63.75 v40.89,63.75
XIN
  Top 0.152: U$1.62 42.22,71.17 42.67,71.63 42.67,72.9 42.42,73.15 39.62,73.15 37.97,71.5 36.45,71.5 36.32,71.37 34.29,71.37 33.91,70.99 33.91,66.43 X1.1 31.62,63.89 C4.1
XOUT
  Top 0.152: U$1.61 42.7,71.14 43.05,71.5 43.05,73.03 42.55,73.53 39.5,73.53 37.85,71.88 36.32,71.88 36.2,71.75 34.16,71.75 33.53,71.12 33.53,70.35 X1.2 30.75,67.58 C5.1
ZOOM  (via drill 0.33)
  Top 0.152: v51.05,51.94 62.48,51.94 ZOOM.3 | U$1.30 47.7,56.69 47.88,56.52 47.88,55.75 49.4,54.23 49.78,54.23 v50.42,53.59
  Bottom 0.152: v50.42,53.59 50.42,52.58 v51.05,51.94